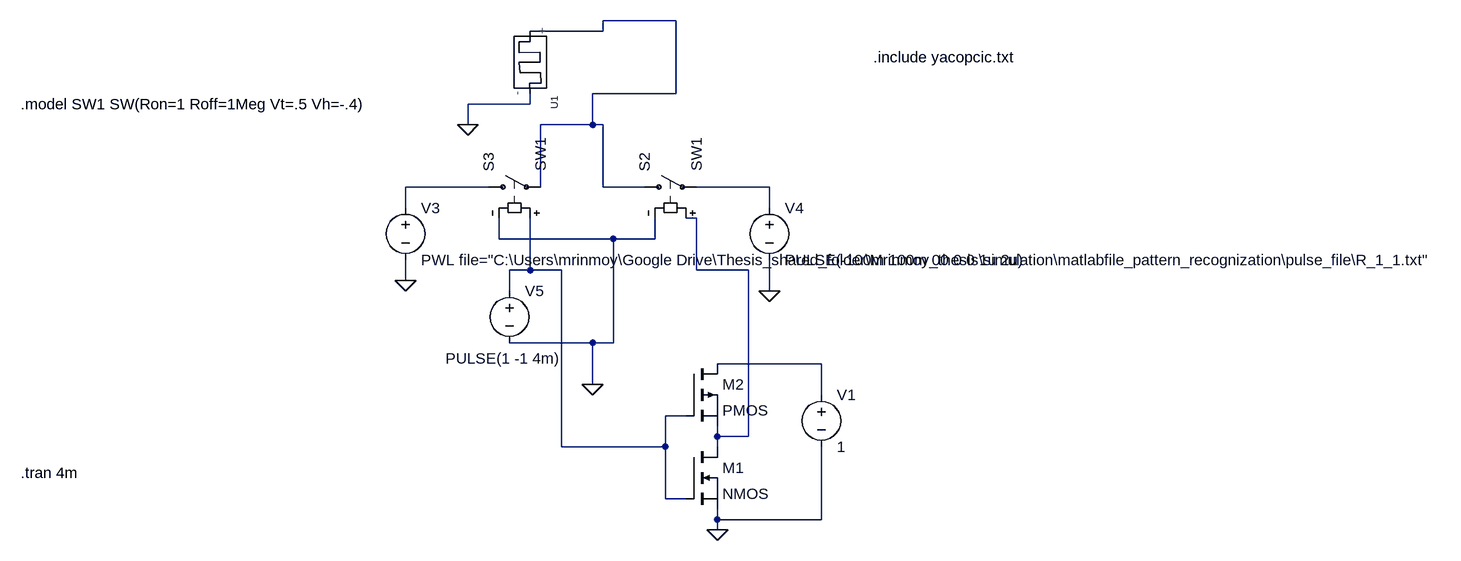
[diagram p0: schematic programmer_test.asc]
programmer_test.asc, the LTspice schematic file:
Version 4
SHEET 1 1328 680
WIRE -208 -144 -320 -144
WIRE -320 -128 -320 -144
WIRE -320 -128 -432 -128
WIRE -208 -32 -208 -144
WIRE -208 -32 -336 -32
WIRE -432 -16 -432 -32
WIRE -432 -16 -528 -16
WIRE -528 16 -528 -16
WIRE -336 16 -336 -32
WIRE -336 16 -416 16
WIRE -320 16 -336 16
WIRE -496 112 -624 112
WIRE -416 112 -416 16
WIRE -320 112 -320 16
WIRE -256 112 -320 112
WIRE -64 112 -176 112
WIRE -624 144 -624 112
WIRE -64 144 -64 112
WIRE -176 160 -192 160
WIRE -480 192 -480 160
WIRE -304 192 -480 192
WIRE -240 192 -240 160
WIRE -240 192 -304 192
WIRE -432 240 -432 160
WIRE -432 240 -464 240
WIRE -384 240 -432 240
WIRE -176 240 -176 160
WIRE -96 240 -176 240
WIRE -624 256 -624 224
WIRE -464 272 -464 240
WIRE -64 272 -64 224
WIRE -336 352 -464 352
WIRE -304 352 -304 192
WIRE -304 352 -336 352
WIRE 16 384 -144 384
WIRE -336 416 -336 352
WIRE 16 432 16 384
WIRE -192 464 -224 464
WIRE -144 496 -144 480
WIRE -96 496 -96 240
WIRE -96 496 -144 496
WIRE -384 512 -384 240
WIRE -224 512 -224 464
WIRE -224 512 -384 512
WIRE -144 512 -144 496
WIRE -224 592 -224 512
WIRE -192 592 -224 592
WIRE -144 624 -144 608
WIRE 16 624 16 512
WIRE 16 624 -144 624
WIRE -144 640 -144 624
FLAG -528 16 0
FLAG -624 256 0
FLAG -64 272 0
FLAG -336 416 0
FLAG -144 640 0
SYMBOL memristormodel -432 -48 R90
SYMATTR InstName U1
SYMATTR Value MEM_YAKOPCIC
SYMBOL voltage -624 128 R0
WINDOW 123 0 0 Left 2
WINDOW 39 0 0 Left 2
SYMATTR InstName V3
SYMATTR Value PWL file="C:\Users\mrinmoy\Google Drive\Thesis_shared_folder\Mrinmoy_thesis\simulation\matlabfile_pattern_recognization\pulse_file\R_1_1.txt"
SYMBOL sw -272 112 R270
SYMATTR InstName S2
SYMATTR Value SW1
SYMBOL sw -512 112 R270
SYMATTR InstName S3
SYMATTR Value SW1
SYMBOL voltage -64 128 R0
WINDOW 123 0 0 Left 2
WINDOW 39 0 0 Left 2
SYMATTR InstName V4
SYMATTR Value PULSE(-100m 100m 00 0 0 1u 2u)
SYMBOL voltage -464 256 R0
WINDOW 123 0 0 Left 2
WINDOW 39 0 0 Left 2
WINDOW 3 -98 120 Left 2
SYMATTR Value PULSE(1 -1 4m)
SYMATTR InstName V5
SYMBOL nmos -192 512 R0
SYMATTR InstName M1
SYMBOL pmos -192 384 R0
SYMATTR InstName M2
SYMBOL voltage 16 416 R0
WINDOW 123 0 0 Left 2
WINDOW 39 0 0 Left 2
SYMATTR InstName V1
SYMATTR Value 1
TEXT 96 -88 Left 2 !.include yacopcic.txt
TEXT -1216 552 Left 2 !.tran 4m
TEXT -1216 -16 Left 2 !.model SW1 SW(Ron=1 Roff=1Meg Vt=.5 Vh=-.4)

The netlist it stands for:
* programmer_test.asc
XU1 N001 0 M MEM_YAKOPCIC  ; pins + -
V3 N002 0 PWL file="C:\Users\mrinmoy\Google Drive\Thesis_shared_folder\Mrinmoy_thesis\simulation\matlabfile_pattern_recognization\pulse_file\R_1_1.txt"
S2 N001 N003 N004 0 SW1
S3 N002 N001 N005 0 SW1
V4 N003 0 PULSE(-100m 100m 00 0 0 1u 2u)
V5 N005 0 PULSE(1 -1 4m)
M1 N004 N005 0 0 NMOS
M2 N006 N005 N004 N004 PMOS
V1 N006 0 1
.model NMOS NMOS
.model PMOS PMOS
.lib standard.mos
.include yacopcic.txt
.tran 4m
.model SW1 SW(Ron=1 Roff=1Meg Vt=.5 Vh=-.4)
.backanno
.end